# EAGLE design 3sensor (EAGLE 6.0)
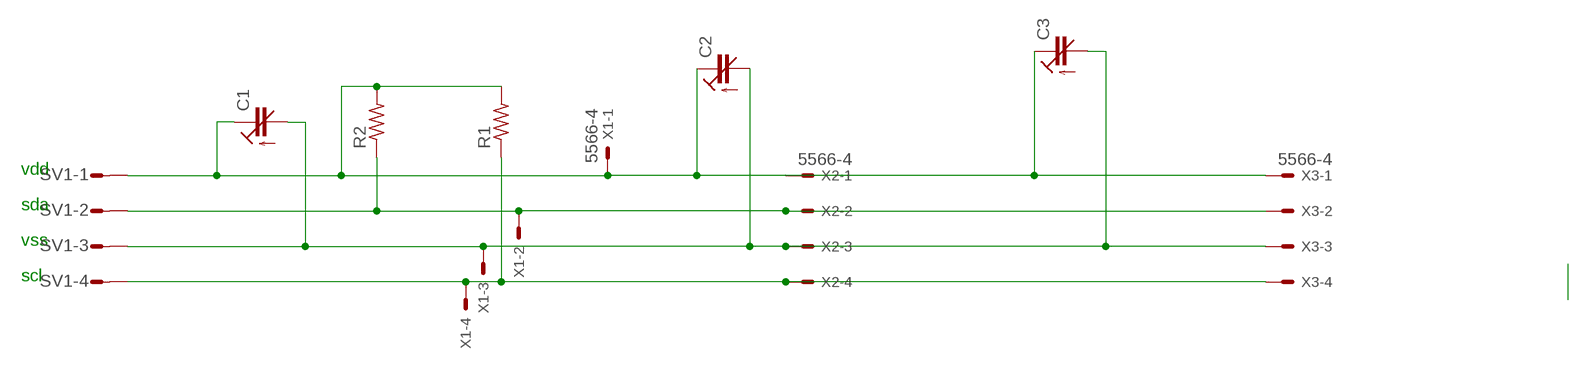
[diagram p0: schematic, sheet 1]

## Parts
C1  C-TRIMM3008  [3008]
C2  C-TRIMM3008  [3008]
C3  C-TRIMM3008  [3008]
R1  R-US_0207/12  [0207/12]
R2  R-US_0207/12  [0207/12]
SV1  L04P  [L04P]
X1  5566-4  [5566-4]
X2  5566-4  [5566-4]
X3  5566-4  [5566-4]

## Nets
N$2: R1.1 SV1.4 X1.4 X2.4 X3.4
N$3: R2.1 SV1.2 X1.2 X2.2 X3.2
VDD: C1.+(E) C2.+(E) C3.+(E) R1.2 R2.2 SV1.1 X1.1 X2.1 X3.1
VSS: C1.-(A) C2.-(A) C3.-(A) SV1.3 X1.3 X2.3 X3.3

## Notes on the sheet
- vdd
- sda
- vss
- scl

## Library data of the parts
C1-C3 = c-trimm:C-TRIMM: Trimm capacitor; OC_FARNELL: unknown; OC_NEWARK: unknown
R1 R2 = rcl:R-US_: RESISTOR, American symbol
SV1 = con-amp-mt:L04P: AMP MT CONNECTOR; OC_FARNELL: unknown; OC_NEWARK: unknown
X1-X3 = con-molex:5566-4: Mini FIT connector 4 pol Source: http://www.molex.com; OC_FARNELL: unknown; OC_NEWARK: unknown

## Board
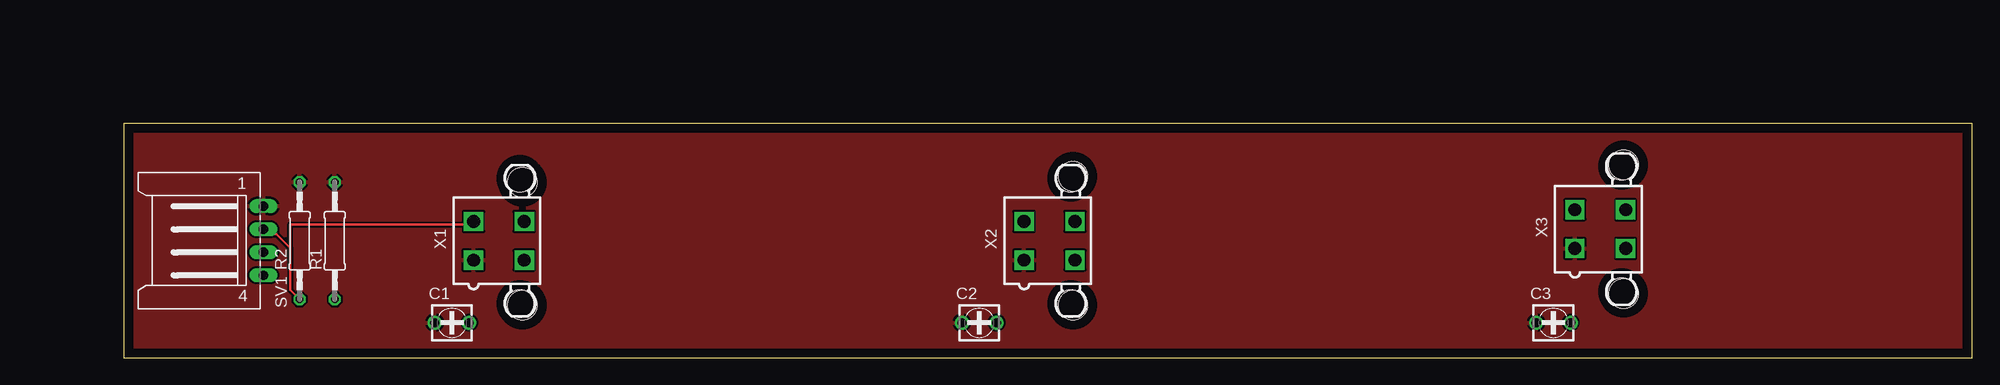
[diagram p1: board, top side]
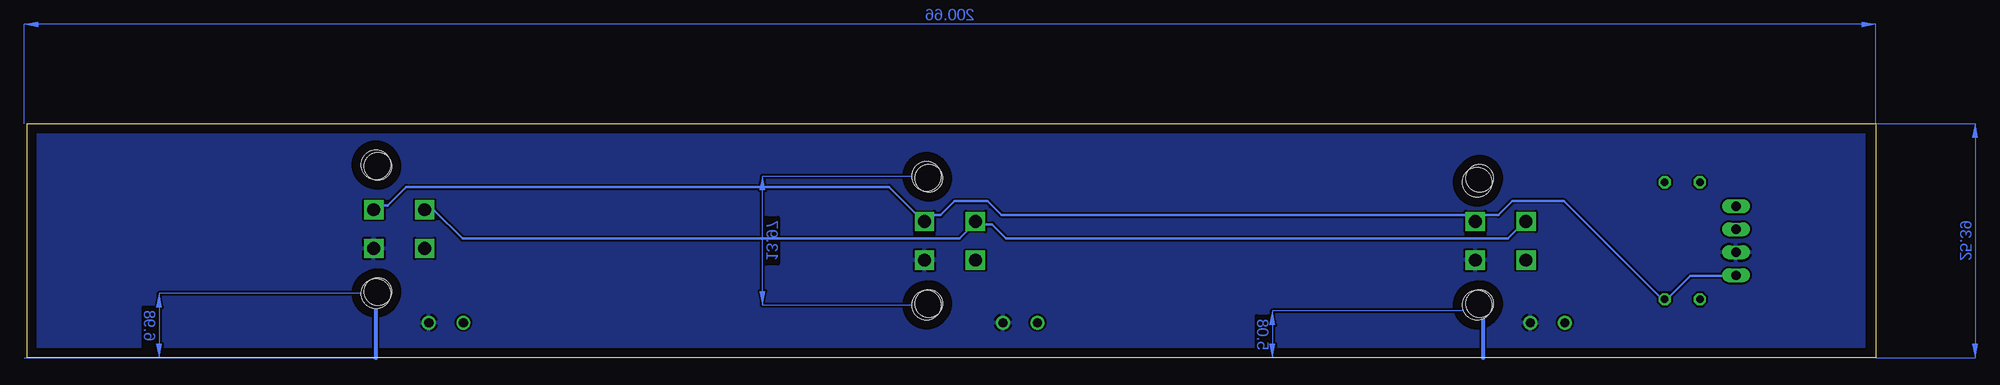
[diagram p2: board, bottom side, seen from below]

Size 200.33 x 25.39 mm. Coordinates in mm from the lower left corner, seen from the top.
Outline: 0,0 200.33,0 200.33,25.39 0,25.39 0,0
Copper layers (1*16): Top 0.035mm / dielectric 1.5mm / Bottom 0.035mm
Design rules: minimum track width 10mil, minimum drill 24mil, track to track 8mil, track to pad 8mil, pad to pad 8mil, via to via 8mil, smd to smd 8mil, copper to edge 40mil, drill to drill 8mil, minimum pad ring 10mil, minimum via ring 8mil, stop-mask expansion 4mil, vias tented up to drill 0mil, thermal gap 10mil
Holes 3.2 mm at 43.18,19.05 43.18,5.71 102.87,5.71 102.87,19.69 162.56,20.95 162.56,6.98

### Footprints (pad centres in the part's own frame; a part is rotated, then mirrored left to right if it is on the bottom)
3008 = drill 1: + -1.875,0; - 1.875,0
0207/12 = drill 0.813 octagon: 1 -6.35,0; 2 6.35,0
L04P = drill 1.016 long: 1 3.75,-6.25; 2 1.25,-6.25; 3 -1.25,-6.25; 4 -3.75,-6.25
5566-4 = drill 1.4 square: 1 2.1,-2.75; 2 -2.1,-2.75; 3 2.1,2.75; 4 -2.1,2.75 | hole 3: 6.8,2.29; -6.8,2.29

### Placement (x,y rotation side)
C1  35.56,3.81 0 top
C2  92.71,3.81 0 top
C3  154.94,3.81 0 top
R1  22.86,12.7 90 top
R2  19.05,12.7 90 top
SV1  8.89,12.7 90 top
X1  40.64,12.7 270 top
X2  100.33,12.7 270 top
X3  160.02,13.97 270 top

### Tracks (layer width: path | path; a pad name or v marks a point on that pad's centre or on a via)
N$1
  Bottom 0.406: 162.56,6.98 162.56,0
N$2
  Bottom 0.254: SV1.4 15.49,8.89 20.07,8.89 22.61,6.35 R1.1 23.11,6.35 33.78,17.02 39.37,17.02 40.89,15.49 42.42,15.49 42.93,14.99 X1.4 43.43,14.99 43.94,15.49 94.74,15.49 96.27,17.02 99.82,17.02 101.35,15.49 103.89,15.49 | 103.89,15.49 106.93,18.54 159.26,18.54 161.29,16.51 162.31,16.51 X3.4 | 103.89,15.49 103.38,14.99 X2.4 103.89,15.49
N$3
  Top 0.254: R2.1 18.03,7.37 18.03,11.94 | 18.03,11.94 16.51,13.46 15.49,13.46 SV1.2 | 18.03,11.94 18.03,14.48 37.85,14.48 X1.2
  Bottom 0.254: X3.2 157.23,16 156.21,16 153.16,12.95 99.31,12.95 97.79,14.48 X2.2 97.28,14.48 95.76,14.48 94.23,12.95 39.88,12.95 38.35,14.48 X1.2
N$4
  Bottom 0.406: 42.55,5.08 42.55,0
VDD
  pour Top: 0,25.4 200.66,25.4 200.66,0 0,0
VSS
  pour Bottom: 1.27,25.4 200.66,25.4 200.66,0 1.27,0
(copper drawn outside any net)
  shapes: Bottom area x8